# Altium schematic sheet KORUZA_RPi_shield.SchDoc
size A4
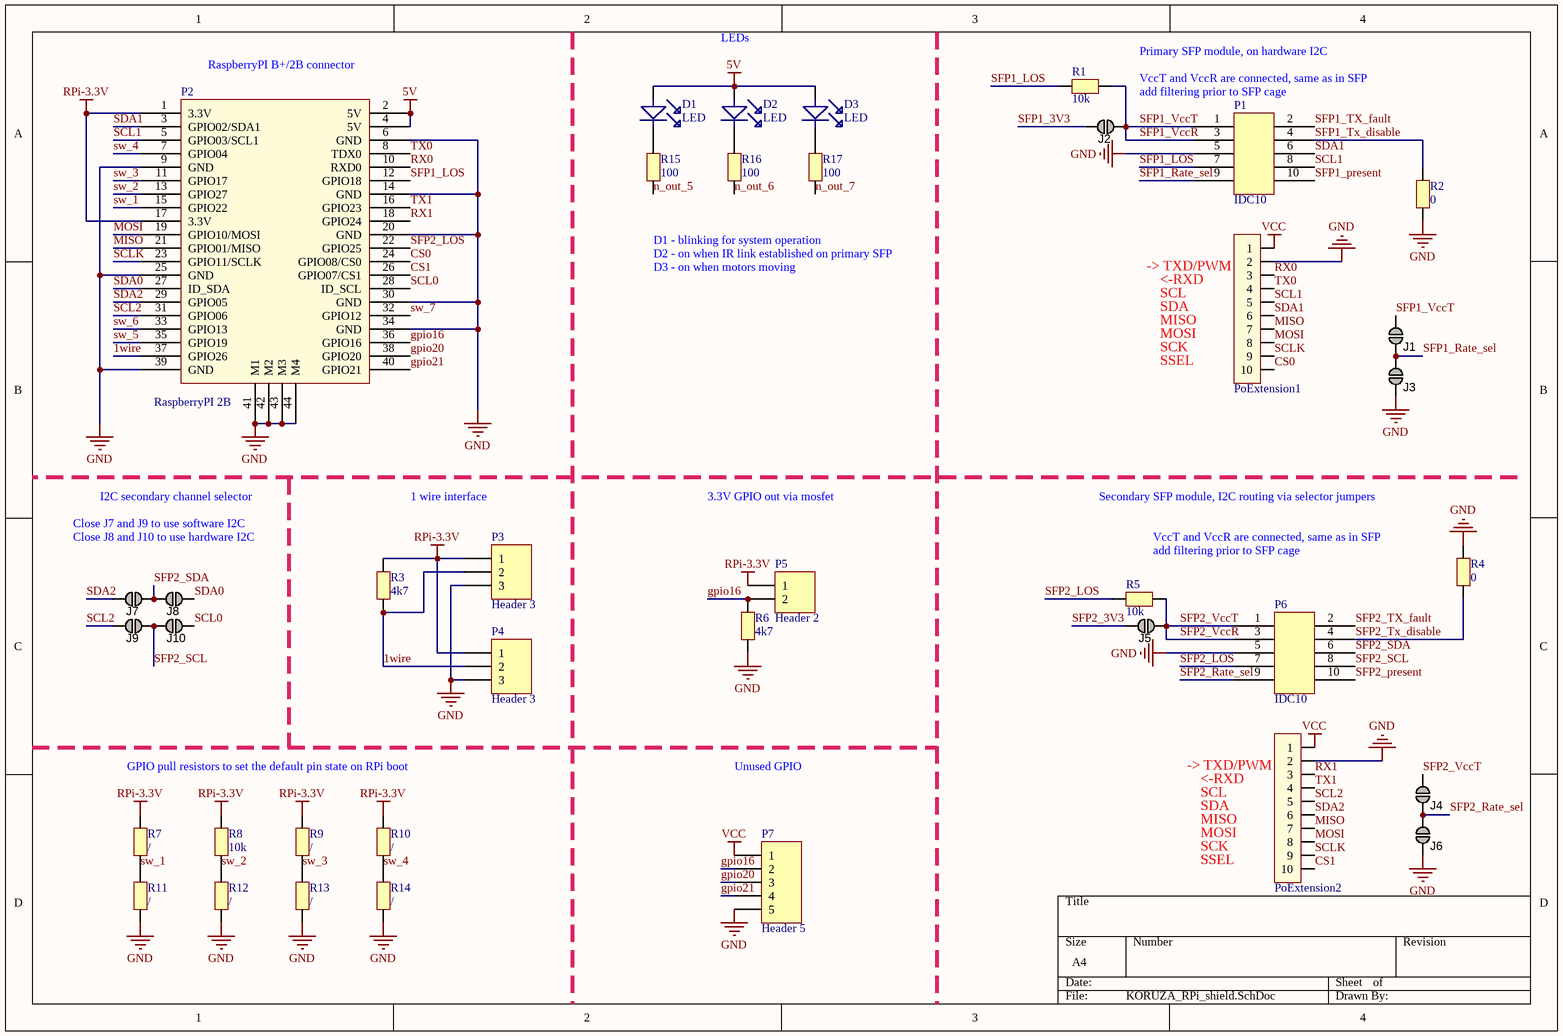
[diagram p0: KORUZA_RPi_shield.SchDoc]

## Parts
D1  LED  [1206/0805 diode]
D2  LED  [1206/0805 diode]
D3  LED  [1206/0805 diode]
J1  Jumper  [JUMP1]  (value not drawn)  (no BOM)
J2  Jumper  [JUMP1]  (value not drawn)  (no BOM)
J3  Jumper  [JUMP1]  (value not drawn)  (no BOM)
J4  Jumper  [JUMP1]  (value not drawn)  (no BOM)
J5  Jumper  [JUMP1]  (value not drawn)  (no BOM)
J6  Jumper  [JUMP1]  (value not drawn)  (no BOM)
J7  Jumper  [JUMP1]  (value not drawn)  (no BOM)
J8  Jumper  [JUMP1]  (value not drawn)  (no BOM)
J9  Jumper  [JUMP1]  (value not drawn)  (no BOM)
J10  Jumper  [JUMP1]  (value not drawn)  (no BOM)
P1  IDC10  [IDC10]
P2  RaspberryPI 2B  [RaspberryPI_B+]
P3  Header 3  [HDR1X3]
P4  Header 3  [HDR1X3]
P5  Header 2  [HDR1X2]
P6  IDC10  [IDC10]
P7  Header 5  [HDR1X5]
PoExtension1  (no value)  [8-188275-0]
PoExtension2  (no value)  [8-188275-0]
R1  10k  [RESC2012X06N]
R2  0  [RESC2012X06N]
R3  4k7  [RESC2012X06N]
R4  0  [RESC2012X06N]
R5  10k  [RESC2012X06N]
R6  4k7  [RESC2012X06N]
R7  /  [RESC2012X06N]
R8  10k  [RESC2012X06N]
R9  /  [RESC2012X06N]
R10  /  [RESC2012X06N]
R11  /  [RESC2012X06N]
R12  /  [RESC2012X06N]
R13  /  [RESC2012X06N]
R14  /  [RESC2012X06N]
R15  100  [RESC2012X06N]
R16  100  [RESC2012X06N]
R17  100  [RESC2012X06N]

## Nets
5V: D1.1 D2.1 D3.1 P2.2(5V) P2.4(5V)
GND: J3.1 J6.1 P1.5 P2.6(GND) P2.9(GND) P2.14(GND) P2.20(GND) P2.25(GND) P2.30(GND) P2.34(GND) P2.39(GND) P2.41(M1) P2.42(M2) P2.43(M3) P2.44(M4) P3.3 P4.3 P6.5 P7.5 PoExtension1.2 PoExtension2.2 R2.1 R4.2 R6.1 R11.1 R12.1 R13.1 R14.1
RPi-3.3V: P2.1(3.3V) P2.17(3.3V) P3.1 P4.1 P5.1 R3.2 R7.2 R8.2 R9.2 R10.2
VCC: P7.1 PoExtension1.1 PoExtension2.1
1wire: P2.37(GPIO26) P3.2 P4.2 R3.1
CS0: P2.24(GPIO08/CS0) PoExtension1.10
CS1: P2.26(GPIO07/CS1) PoExtension2.10
gpio16: P2.36(GPIO16) P5.2 P7.2 R6.2
gpio20: P2.38(GPIO20) P7.3
gpio21: P2.40(GPIO21) P7.4
MISO: P2.21(GPIO01/MISO) PoExtension1.7 PoExtension2.7
MOSI: P2.19(GPIO10/MOSI) PoExtension1.8 PoExtension2.8
n_out_5: R15.1
n_out_6: R16.1
n_out_7: R17.1
RX0: P2.10(RXD0) PoExtension1.3
RX1: P2.18(GPIO24) PoExtension2.3
SCL0: J10.2 P2.28(ID_SCL)
SCL1: P1.8 P2.5(GPIO03/SCL1) PoExtension1.5
SCL2: J9.1 P2.31(GPIO06) PoExtension2.5
SCLK: P2.23(GPIO11/SCLK) PoExtension1.9 PoExtension2.9
SDA0: J8.2 P2.27(ID_SDA)
SDA1: P1.6 P2.3(GPIO02/SDA1) PoExtension1.6
SDA2: J7.1 P2.29(GPIO05) PoExtension2.6
SFP1_3V3: J2.1
SFP1_LOS: P1.7 P2.12(GPIO18) R1.2
SFP1_present: P1.10
SFP1_Rate_sel: J1.1 J3.2 P1.9
SFP1_Tx_disable: P1.4 R2.2
SFP1_TX_fault: P1.2
SFP1_VccR: J1.2 J2.2 P1.1(A) P1.3 R1.1  [also labelled SFP1_VccT]
SFP2_3V3: J5.1
SFP2_LOS: P2.22(GPIO25) P6.7 R5.2
SFP2_present: P6.10
SFP2_Rate_sel: J4.1 J6.2 P6.9
SFP2_SCL: J9.2 J10.1 P6.8
SFP2_SDA: J7.2 J8.1 P6.6
SFP2_Tx_disable: P6.4 R4.1
SFP2_TX_fault: P6.2
SFP2_VccR: J4.2 J5.2 P6.1(A) P6.3 R5.1  [also labelled SFP2_VccT]
sw_1: P2.15(GPIO22) R7.1 R11.2
sw_2: P2.13(GPIO27) R8.1 R12.2
sw_3: P2.11(GPIO17) R9.1 R13.2
sw_4: P2.7(GPIO04) R10.1 R14.2
sw_5: P2.35(GPIO19)
sw_6: P2.33(GPIO13)
sw_7: P2.32(GPIO12)
TX0: P2.8(TDX0) PoExtension1.4
TX1: P2.16(GPIO23) PoExtension2.4
NetD1_2: D1.2 R15.2
NetD2_2: D2.2 R16.2
NetD3_2: D3.2 R17.2

## Notes on the sheet
- LEDs
- (near P2) RaspberryPI B+/2B connector
- VccT and VccR are connected, same as in SFP
- add filtering prior to SFP cage
- Primary SFP module, on hardware I2C
- D1 - blinking for system operation
- D2 - on when IR link established on primary SFP
- D3 - on when motors moving
- (near PoExtension1) -> TXD/PWM
- <-RXD
- SCL
- SDA
- MISO
- MOSI
- SCK
- SSEL
- I2C secondary channel selector
- 1 wire interface
- 3.3V GPIO out via mosfet
- Secondary SFP module, I2C routing via selector jumpers
- Close J7 and J9 to use software I2C
- Close J8 and J10 to use hardware I2C
- (near R5) add filtering prior to SFP cage
- GPIO pull resistors to set the default pin state on RPi boot
- Unused GPIO
- (near PoExtension2) -> TXD/PWM

## Library data of the parts
D1-D3 = LED: LED diode
J1-J10 = JUMP1: SMD jumper
P1 P6 = IDC10: IDC 10pin
P2 = RaspberryPI 2B: RPi2
P3 P4 = Header 3: Header, 3-Pin; LatestRevisionDate: 17-Jul-2002; LatestRevisionNote: Re-released for DXP Platform.; Publisher: Altium Limited
P5 = Header 2: Header, 2-Pin; LatestRevisionDate: 17-Jul-2002; LatestRevisionNote: Re-released for DXP Platform.; Publisher: Altium Limited
P7 = Header 5: Header, 5-Pin; LatestRevisionDate: 17-Jul-2002; LatestRevisionNote: Re-released for DXP Platform.; Publisher: Altium Limited
PoExtension1 PoExtension2 = 1-215079-0: Micro-Match female PCB connector 10 Positions THT
R1-R17 = Resistor: Resistor 0805 smd